# EAGLE design MRCS-Tortoise-to-MP-Adapter (EAGLE 7.7.0)
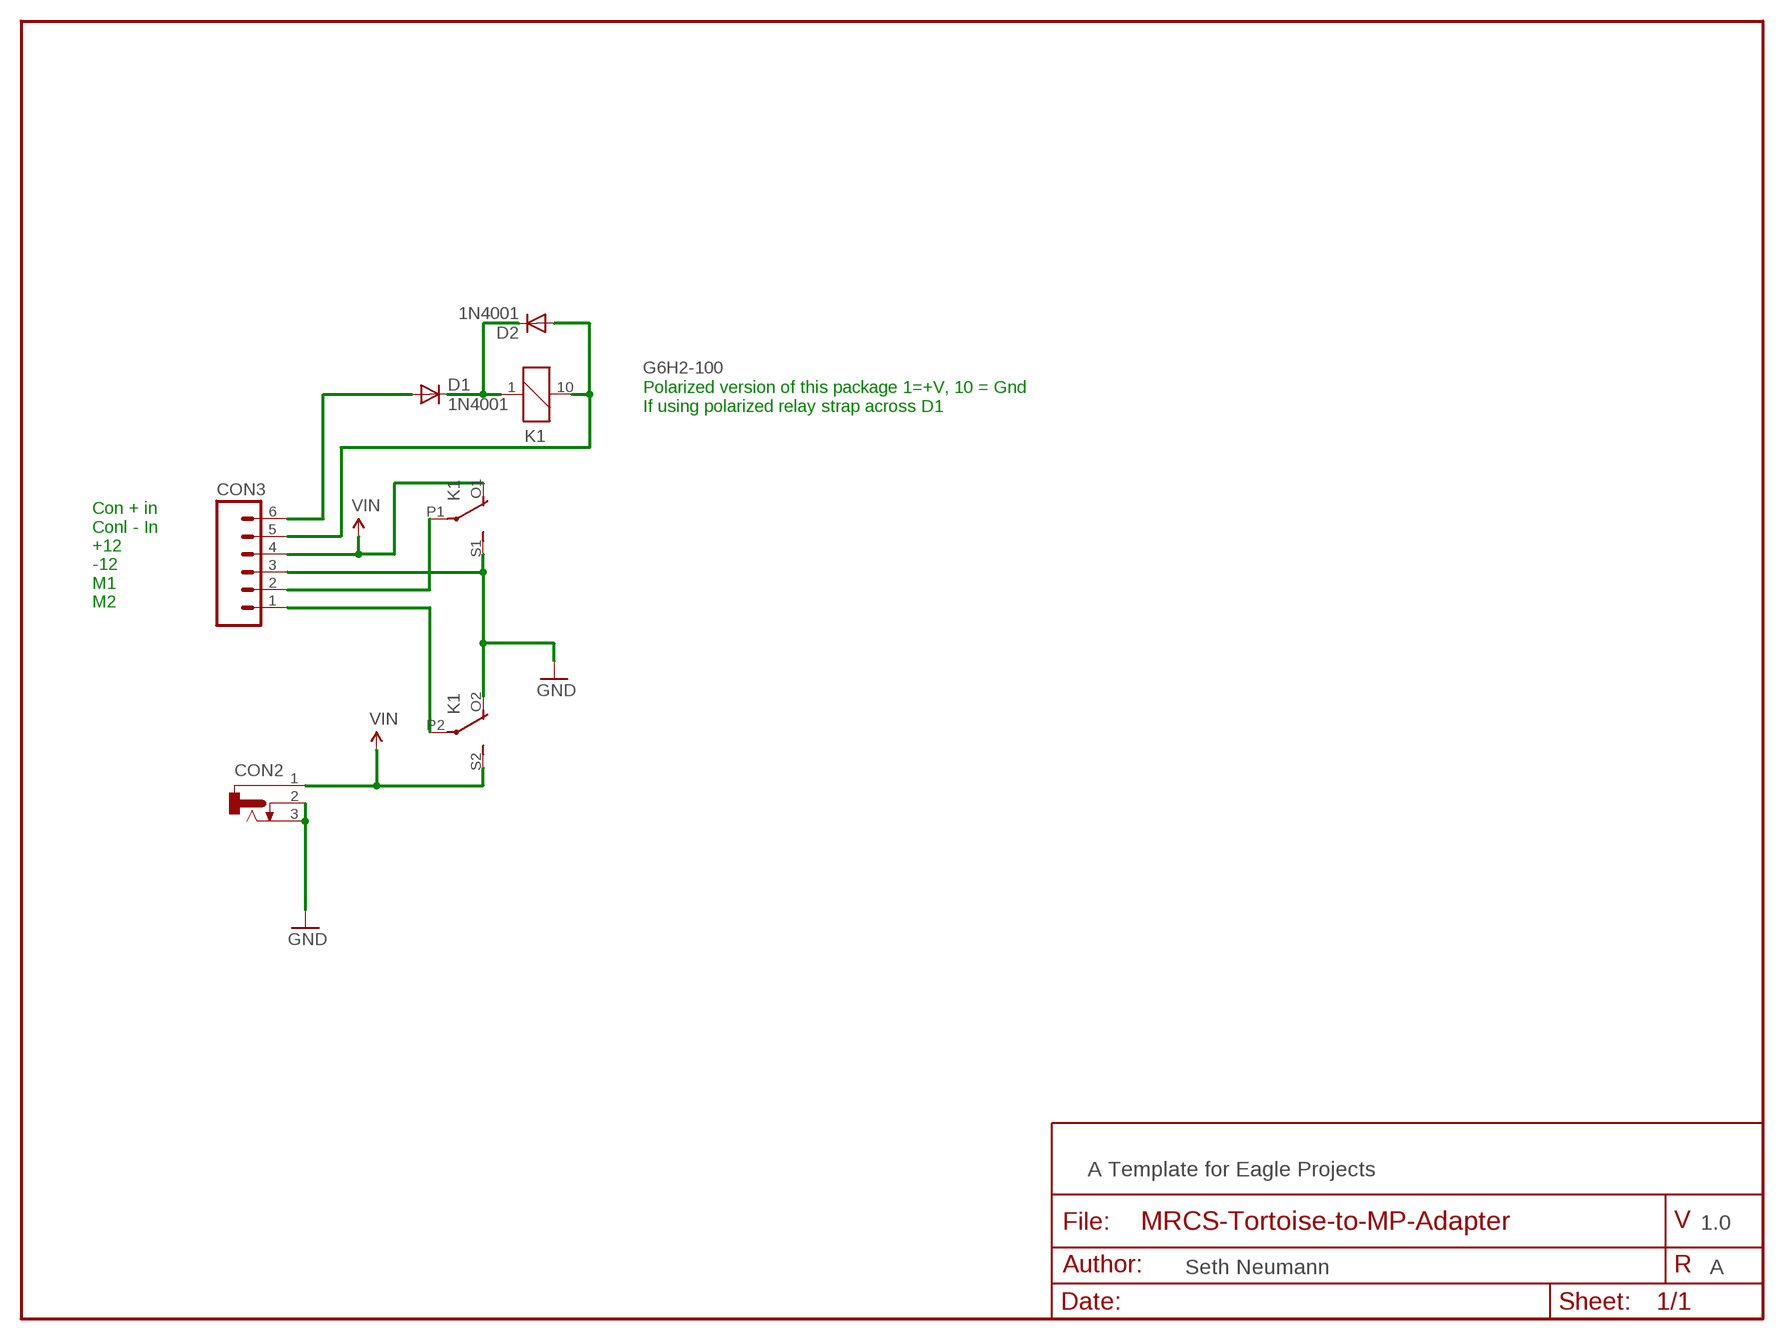
[diagram p0: schematic, sheet 1]

## Parts
CON2  CONNECTOR-DC-POWER-RA  [DCJ0202]
CON3  CONNECTOR-M063.5MM-6  [SCREWTERMINAL-3.5MM-6]
D1  1N4001  DIODEPTH  [DIODE-1N4001]
D2  1N4001  DIODEPTH  [DIODE-1N4001]
K1  G6H2-100  [G6H2-100]

## Nets
GND: CON2.2 CON2.3 CON3.3 K1.O2(3:O) K1.S1(2:S)
N$1: CON3.6 D1.A
N$2: D1.C D2.C K1.1
N$3: CON3.5 D2.A K1.10
N$6: CON3.2 K1.P1(2:P)
N$7: CON3.1 K1.P2(3:P)
VIN: CON2.1 CON3.4 K1.O1(2:O) K1.S2(3:S)

## Notes on the sheet
- Polarized version of this package 1=+V, 10 = Gnd
  If using polarized relay strap across D1
- Con + in
  Conl - In
  +12
  -12
  M1
  M2
- A Template for Eagle Projects
- 1.0
- Seth Neumann | A

## Library data of the parts
CON2 = SPCoast:CONNECTOR-DC-POWER: DC POWER JACK
CON3 = SPCoast:CONNECTOR-M06: Header 6 Standard 6-pin 0.1" header
D1 D2 = SPCoast:DIODE: Diode These are standard reverse protection diodes and small signal diodes. SMA package can handle up to about 1A. SOD-323 can handle about 200mA. What the SOD-323 package when ordering, there are some mfgs out there that are 5-pin packages.
K1 = relay:G6H2-100: RELAY 2 x switch, 0.5 A/125 V AC, 1 A/30 V DC, Omron; OC_FARNELL: unknown; OC_NEWARK: unknown

## Board
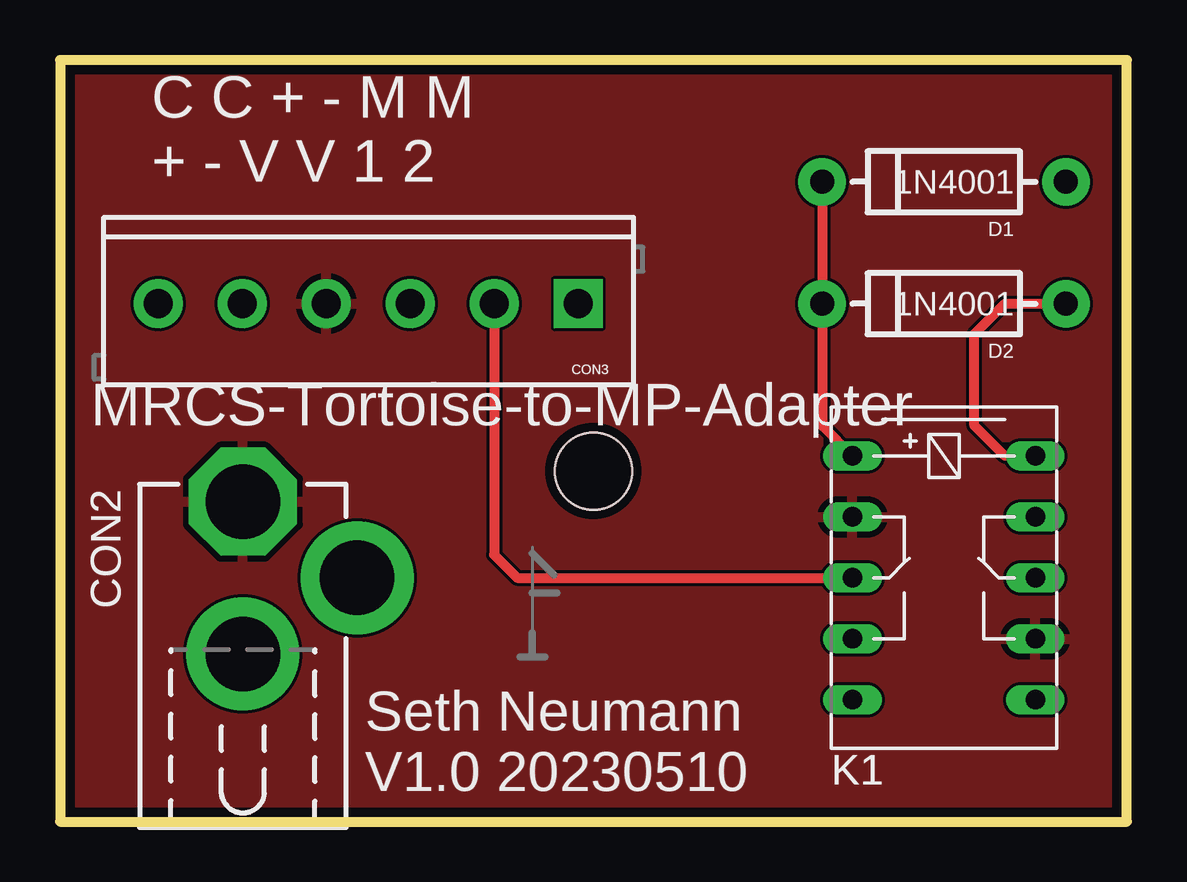
[diagram p1: board, top side]
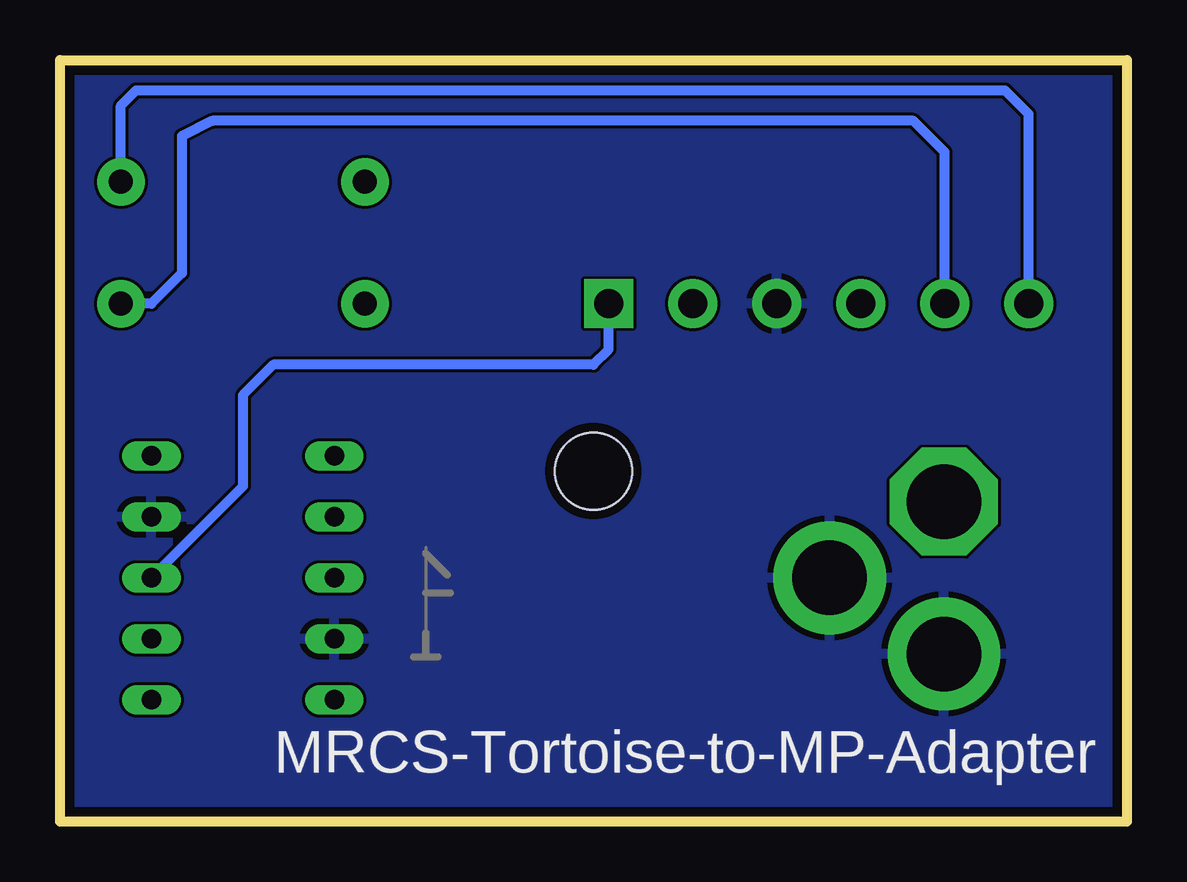
[diagram p2: board, bottom side, seen from below]

Size 44.45 x 31.75 mm. Coordinates in mm from the lower left corner, seen from the top.
Outline: 0,0 44.45,0 44.45,31.75 0,31.75 0,0
Copper layers (1*16): Top 0.035mm / dielectric 1.5mm / Bottom 0.035mm
Design rules "default *": minimum track width 5mil, minimum drill 0.2mm, track to track 5mil, track to pad 5mil, pad to pad 5mil, via to via 5mil, smd to smd 5mil, copper to edge 0.4mm, drill to drill 5mil, minimum pad ring 3mil, minimum via ring 3mil, stop-mask expansion 4mil, vias tented up to drill 0mil, thermal gap 10mil
Holes 3.2 mm at 22.23,14.61

### Footprints (pad centres in the part's own frame; a part is rotated, then mirrored left to right if it is on the bottom)
DCJ0202 = drill 3.1 pad 4.5 octagon: 1 0,3.175 | drill 3.1 pad 4.7: 2 4.763,0; 3 0,-3.175
SCREWTERMINAL-3.5MM-6 = drill 1.2 pad 2.032 square: 1 0,0 | drill 1.2 pad 2.032: 2 3.5,0; 3 7,0; 4 10.5,0; 5 14,0; 6 17.5,0
DIODE-1N4001 = drill 1 pad 1.981: A 5.08,0; C -5.08,0
G6H2-100 = drill 0.813 long: 1 -5.08,-3.81; 5 5.08,-3.81; 6 5.08,3.81; 10 -5.08,3.81; O1 -2.54,-3.81; O2 -2.54,3.81; P1 0,-3.81; P2 0,3.81; S1 2.54,-3.81; S2 2.54,3.81

### Placement (x,y rotation side)
CON2  7.62,10.16 0 top
CON3  21.59,21.59 180 top
D1  36.83,26.67 0 top
D2  36.83,21.59 0 top
K1  36.83,10.16 270 top
U$1  [MRCSLOGOTOP]  18.41,6.35 0 top
U$2  [CA-PROP65WARNING]  24.13,26.67 0 top
U$3  [MRCSLOGOBTM]  22.86,6.35 0 top

### Tracks (layer width: path | path; a pad name or v marks a point on that pad's centre or on a via)
GND
  pour Bottom: 0,0 44.45,0 44.45,31.75 0,31.75
N$1
  Bottom 0.406: D1.A 41.91,29.84 41.27,30.48 5.08,30.48 4.09,29.49 CON3.6
N$2
  Top 0.406: D1.C D2.C 31.75,16.51 K1.1
N$3
  Top 0.406: K1.10 39.37,15.24 38.1,16.51 38.1,20.32 39.37,21.59 D2.A
  Bottom 0.406: CON3.5 7.59,27.91 8.89,29.21 38.1,29.21 39.37,28.57 39.37,22.86 40.64,21.59 D2.A
N$6
  Top 0.406: CON3.2 18.09,11.12 19.05,10.16 K1.P1
N$7
  Bottom 0.406: K1.P2 36.83,13.97 36.83,17.78 35.56,19.05 22.23,19.05 21.59,19.68 CON3.1
VIN
  pour Top: 0,0 44.45,0 44.45,31.75 0,31.75

### Text on the board
tPlace: C C + - M M / + - V V 1 2 | Seth Neumann / V1.0 20230510
_tNames: D1 | D2 | CON3 | CON2 | K1